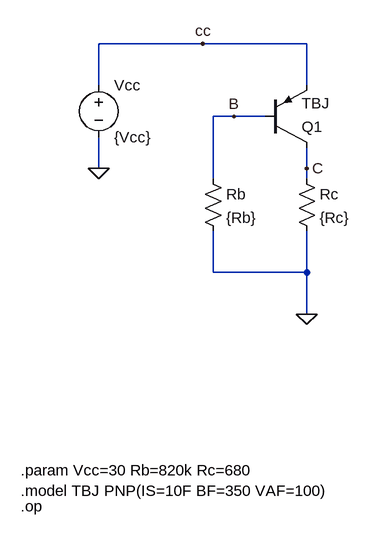
[diagram p0: schematic TBJPNP01CAop.asc]
TBJPNP01CAop.asc, the LTspice schematic file:
Version 4
SHEET 1 1608 1076
WIRE 128 -16 -32 -16
WIRE 288 -16 128 -16
WIRE -32 48 -32 -16
WIRE 288 48 288 -16
WIRE 176 96 144 96
WIRE 224 96 176 96
WIRE -32 176 -32 128
WIRE 288 176 288 144
WIRE 144 192 144 96
WIRE 288 192 288 176
WIRE 144 336 144 272
WIRE 288 336 288 272
WIRE 288 336 144 336
WIRE 288 400 288 336
FLAG -32 176 0
FLAG 288 400 0
FLAG 128 -16 cc
FLAG 176 96 B
FLAG 288 176 C
SYMBOL res 128 176 R0
SYMATTR InstName Rb
SYMATTR Value {Rb}
SYMBOL res 272 176 R0
SYMATTR InstName Rc
SYMATTR Value {Rc}
SYMBOL voltage -32 32 R0
WINDOW 123 0 0 Left 0
WINDOW 39 0 0 Left 0
SYMATTR InstName Vcc
SYMATTR Value {Vcc}
SYMBOL pnp 224 144 M180
SYMATTR InstName Q1
SYMATTR Value TBJ
TEXT -152 640 Left 2 !.param Vcc=30 Rb=820k Rc=680
TEXT -152 696 Left 2 !.op
TEXT -152 672 Left 2 !.model TBJ PNP(IS=10F BF=350 VAF=100)

The netlist it stands for:
* TBJPNP01CAop.asc
Rb B 0 {Rb}
Rc C 0 {Rc}
Vcc cc 0 {Vcc}
Q1 C B cc 0 TBJ
.model NPN NPN
.model PNP PNP
.lib standard.bjt
.param Vcc=30 Rb=820k Rc=680
.op
.model TBJ PNP(IS=10F BF=350 VAF=100)
.backanno
.end